# Altium project WiFiNode_R00.PrjPcb
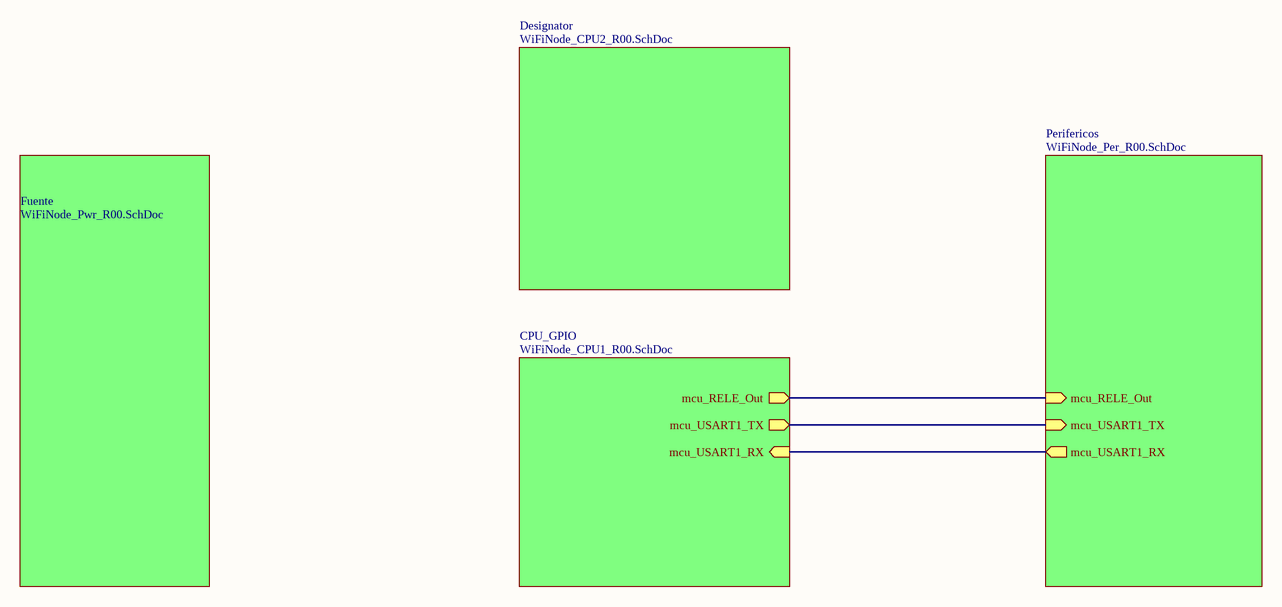
[diagram p0: WiFiNode_Blk_R00.SchDoc]
5 sheets, 52 parts. Net scope: hierarchical (ports join the sheet entries above them; power ports are global).
Board files: WiFiNode_R00.PcbDoc, WiFiNode_panel.PcbDoc
Sheets:
  WiFiNode_Blk_R00.SchDoc
    Fuente = WiFiNode_Pwr_R00.SchDoc
    Designator = WiFiNode_CPU2_R00.SchDoc
    CPU_GPIO = WiFiNode_CPU1_R00.SchDoc
    Perifericos = WiFiNode_Per_R00.SchDoc

## Sheet WiFiNode_Blk_R00.SchDoc: Nodo WiFi
size A4; Author: Hernan M. Travado; Revision: 0; SheetNumber: 1; SheetTotal: 5

### Sub-sheets
CPU_GPIO = WiFiNode_CPU1_R00.SchDoc: mcu_RELE_Out (out), mcu_USART1_TX (out), mcu_USART1_RX (in)
Designator = WiFiNode_CPU2_R00.SchDoc: no entries
Fuente = WiFiNode_Pwr_R00.SchDoc: no entries
Perifericos = WiFiNode_Per_R00.SchDoc: mcu_RELE_Out (in), mcu_USART1_TX (in), mcu_USART1_RX (out)

### Nets
mcu_RELE_OUT: sheet CPU_GPIO/mcu_RELE_Out, sheet Perifericos/mcu_RELE_Out
mcu_USART1_RX: sheet CPU_GPIO/mcu_USART1_RX, sheet Perifericos/mcu_USART1_RX
mcu_USART1_TX: sheet CPU_GPIO/mcu_USART1_TX, sheet Perifericos/mcu_USART1_TX

### Notes on the sheet
- Title:
- Size:
- Author:
- A4
- Sheet
- of
- Revision:
- File:
- Date:

## Sheet WiFiNode_Pwr_R00.SchDoc: Nodo WiFi
size A4; Author: Hernan M. Travado; Revision: 0; SheetNumber: 2; SheetTotal: 5
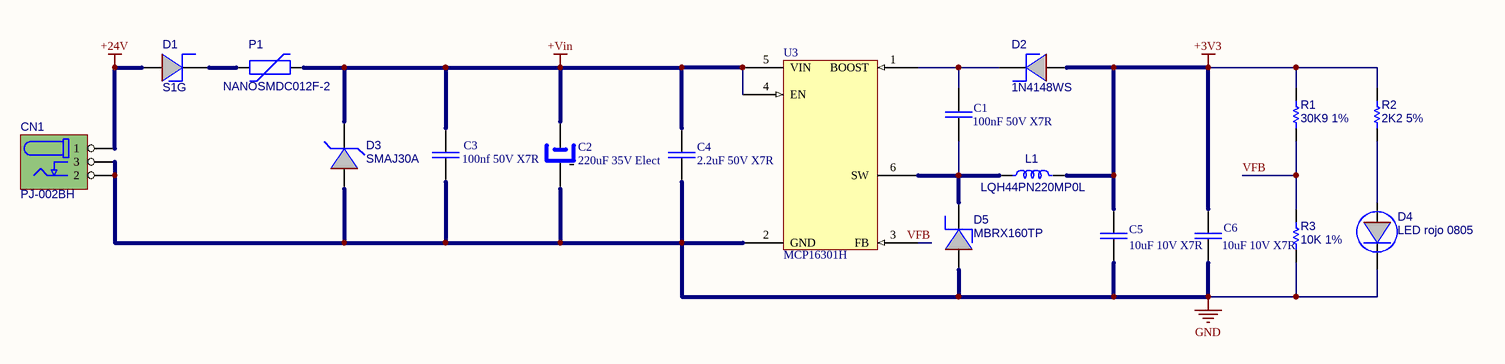
[diagram p1: WiFiNode_Pwr_R00.SchDoc]

### Parts
C1  100nF 50V X7R  [C_0805]
C2  220uF 35V Elect  [C_RAD_0.135_H_8X12_S]
C3  100nf 50V X7R  [C_0805]
C4  2.2uF 50V X7R  [C_0805]
C5  10uF 10V X7R  [C_0805]
C6  10uF 10V X7R  [C_0805]
CN1  PJ-002BH  [PJ002B]
D1  S1G  [D_SMA]
D2  1N4148WS  [SOD_323]
D3  SMAJ30A  [D_SMA]
D4  LED rojo 0805  [D_0805]
D5  MBRX160TP  [SOD_123]
L1  LQH44PN220MP0L  [LQH44]
P1  NANOSMDC012F-2  [NANOSMDC]
R1  30K9 1%  [R_0805]
R2  2K2 5%  [R_0805]
R3  10K 1%  [R_0805]
U3  MCP16301H  [SOT23-6]

### Nets
+3V3: C5.1 C6.1 D2.1(A) L1.2 R1.2 R2.2
+24V: CN1.1 D1.1(A)
+Vin: C2.1 C3.1 C4.1 D3.2(K) P1.2 U3.4(EN) U3.5(VIN)
GND: C2.2 C3.2 C4.2 C5.2 C6.2 CN1.2 CN1.3 D3.1(A) D4.2(K) D5.1(A) R3.1 U3.2(GND)
VFB: R1.1 R3.2 U3.3(FB)
NetC1_1: C1.1 D2.2(K) U3.1(BOOST)
NetC1_2: C1.2 D5.2(K) L1.1 U3.6(SW)
NetD1_2: D1.2(K) P1.1
NetD4_1: D4.1(A) R2.1

### Notes on the sheet
- Title:
- Size:
- Author:
- A4
- Sheet
- of
- Revision:
- File:
- Date:

### Library data of the parts
C1 C3-C6 = Ceramic capacitor
C2 = Pol capacitor: Polarized Capacitor
CN1 = CN_PowerJack: Barrel Power Connector
D1 D2 D5 = DIODO_SH: Diode Shottky
D3 = DIODE_TVS: Unidirectional TVS
D4 = LED
L1 = IND: Inductor
P1 = PLYSW: Polyswitch
R1-R3 = Res1: Resistor
U3 = MCP16301: Sted down switching

## Sheet WiFiNode_CPU2_R00.SchDoc: Node WiFi
size A4; Author: Hernan M. Travado; Revision: 0; SheetNumber: 5; SheetTotal: 5
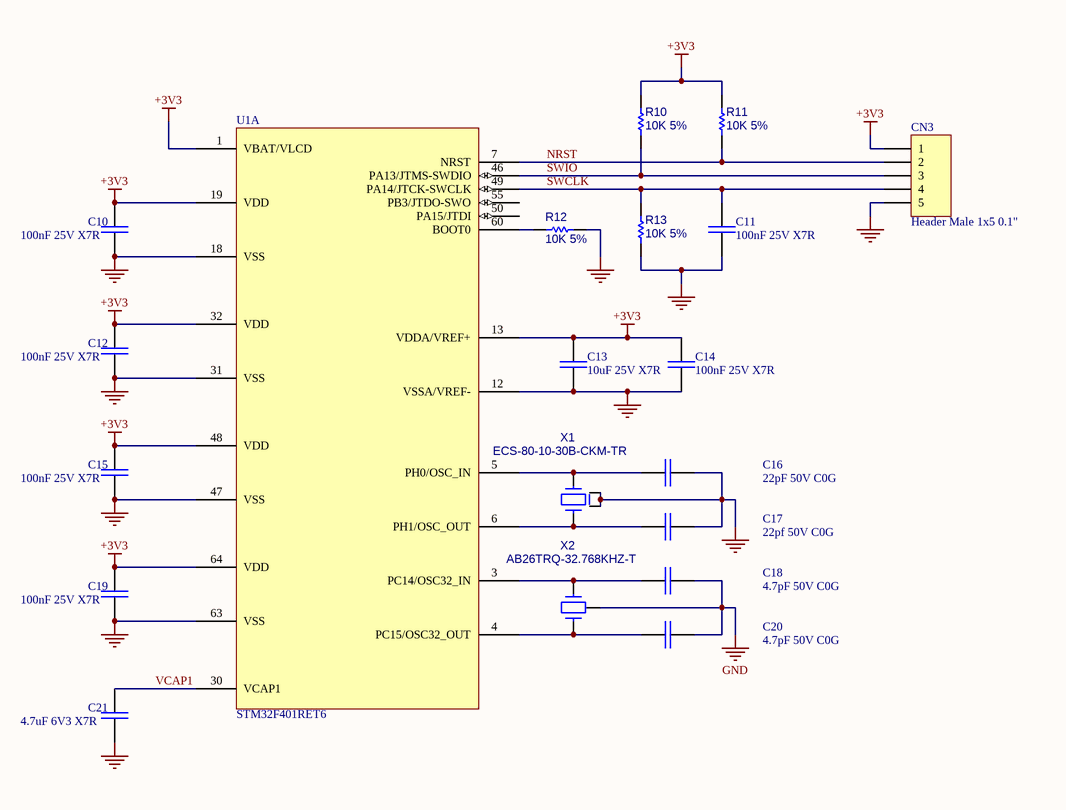
[diagram p2: WiFiNode_CPU2_R00.SchDoc]

### Parts
C10  100nF 25V X7R  [C_0805]
C11  100nF 25V X7R  [C_0805]
C12  100nF 25V X7R  [C_0805]
C13  10uF 25V X7R  [C_0805]
C14  100nF 25V X7R  [C_0805]
C15  100nF 25V X7R  [C_0805]
C16  22pF 50V C0G  [C_0805]
C17  22pf 50V C0G  [C_0805]
C18  4.7pF 50V C0G  [C_0805]
C19  100nF 25V X7R  [C_0805]
C20  4.7pF 50V C0G  [C_0805]
C21  4.7uF 6V3 X7R  [C_0805]
CN3  Header Male 1x5 0.1"  [Header_M_1x5_0.1"]
R10  10K 5%  [R_0805]
R11  10K 5%  [R_0805]
R12  10K 5%  [R_0805]
R13  10K 5%  [R_0805]
U1  STM32F401RET6  [LQFP_64]  (part A of 2)
X1  ECS-80-10-30B-CKM-TR  [ABM3C]
X2  AB26TRQ-32.768KHZ-T  [AB26TQF]

### Nets
+3V3: C10.1 C12.1 C13.1 C14.1 C15.1 C19.1 CN3.1 R10.1 R11.1 U1.1(VBAT/VLCD) U1.13(VDDA/VREF+) U1.19(VDD) U1.32(VDD) U1.48(VDD) U1.64(VDD)
GND: C10.2 C11.2 C12.2 C13.2 C14.2 C15.2 C16.2 C17.2 C18.2 C19.2 C20.2 C21.2 CN3.5 R12.1 R13.2 U1.12(VSSA/VREF-) U1.18(VSS) U1.31(VSS) U1.47(VSS) U1.63(VSS) X1.2 X1.4 X2.3
NRST: CN3.2 R11.2 U1.7(NRST)
SWCLK: C11.1 CN3.4 R13.1 U1.49(PA14/JTCK-SWCLK)
SWIO: CN3.3 R10.2 U1.46(PA13/JTMS-SWDIO)
VCAP1: C21.1 U1.30(VCAP1)
NetC16_1: C16.1 U1.5(PH0/OSC_IN) X1.1
NetC17_1: C17.1 U1.6(PH1/OSC_OUT) X1.3
NetC18_1: C18.1 U1.3(PC14/OSC32_IN) X2.2
NetC20_1: C20.1 U1.4(PC15/OSC32_OUT) X2.1
NetR12_2: R12.2 U1.60(BOOT0)

Not connected (* = marked no-connect by the designer): U1 50(PA15/JTDI) 55(PB3/JTDO-SWO)

### Notes on the sheet
- Title:
- Size:
- Author:
- A4
- Sheet
- of
- Revision:
- File:
- Date:

### Library data of the parts
C10-C21 = Ceramic capacitor
CN3 = CONN_05P: Connector Generic 5 Vias
R10-R13 = Res1: Resistor
U1 = STM32F401RE
X1 = CRYSTAL_4P: Crystal 4 Vias + GND
X2 = CRYSTAL 3P: Crystal 2 Vias + GND

## Sheet WiFiNode_CPU1_R00.SchDoc: Nodo WiFi
size A4; Author: Hernan M. Travado; Revision: 0; SheetNumber: 3; SheetTotal: 5
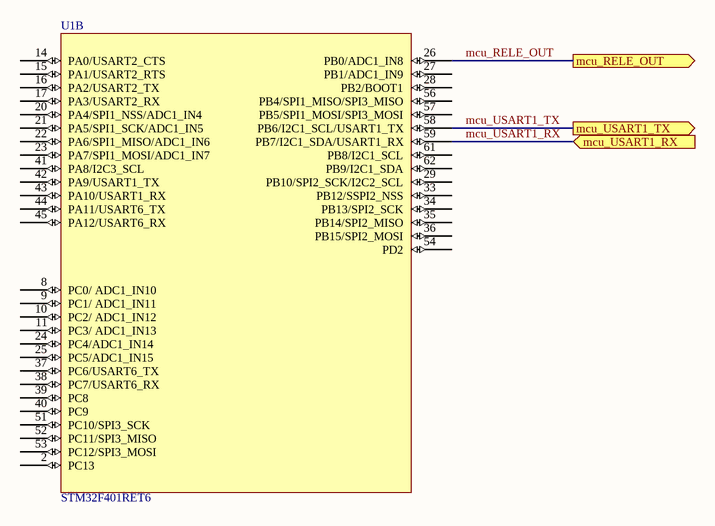
[diagram p3: WiFiNode_CPU1_R00.SchDoc]

### Parts
U1  STM32F401RET6  [LQFP_64]  (part B of 2)

### Ports
mcu_RELE_OUT (out, see WiFiNode_Blk_R00[3C], WiFiNode_Per_R00[1C]), mcu_USART1_RX (in, see WiFiNode_Blk_R00[3C], WiFiNode_Per_R00[3A]), mcu_USART1_TX (out, see WiFiNode_Blk_R00[3C], WiFiNode_Per_R00[3A])

### Nets
mcu_RELE_OUT: U1.26(PB0/ADC1_IN8) ; port mcu_RELE_OUT
mcu_USART1_RX: U1.59(PB7/I2C1_SDA/USART1_RX) ; port mcu_USART1_RX
mcu_USART1_TX: U1.58(PB6/I2C1_SCL/USART1_TX) ; port mcu_USART1_TX

Not connected (* = marked no-connect by the designer): U1 2(PC13) 8(PC0/_ADC1_IN10) 9(PC1/_ADC1_IN11) 10(PC2/_ADC1_IN12) 11(PC3/_ADC1_IN13) 14(PA0/USART2_CTS) 15(PA1/USART2_RTS) 16(PA2/USART2_TX) 17(PA3/USART2_RX) 20(PA4/SPI1_NSS/ADC1_IN4) 21(PA5/SPI1_SCK/ADC1_IN5) 22(PA6/SPI1_MISO/ADC1_IN6) 23(PA7/SPI1_MOSI/ADC1_IN7) 24(PC4/ADC1_IN14) 25(PC5/ADC1_IN15) 27(PB1/ADC1_IN9) 28(PB2/BOOT1) 29(PB10/SPI2_SCK/I2C2_SCL) 33(PB12/SSPI2_NSS) 34(PB13/SPI2_SCK) 35(PB14/SPI2_MISO) 36(PB15/SPI2_MOSI) 37(PC6/USART6_TX) 38(PC7/USART6_RX) 39(PC8) 40(PC9) 41(PA8/I2C3_SCL) 42(PA9/USART1_TX) 43(PA10/USART1_RX) 44(PA11/USART6_TX) 45(PA12/USART6_RX) 51(PC10/SPI3_SCK) 52(PC11/SPI3_MISO) 53(PC12/SPI3_MOSI) 54(PD2) 56(PB4/SPI1_MISO/SPI3_MISO) 57(PB5/SPI1_MOSI/SPI3_MOSI) 61(PB8/I2C1_SCL) 62(PB9/I2C1_SDA)

### Notes on the sheet
- Title:
- Size:
- Author:
- A4
- Sheet
- of
- Revision:
- File:
- Date:

### Library data of the parts
U1 = STM32F401RE

## Sheet WiFiNode_Per_R00.SchDoc: Nodo WiFi
size A4; Author: Hernan M. Travado; Revision: 0; SheetNumber: 4; SheetTotal: 5
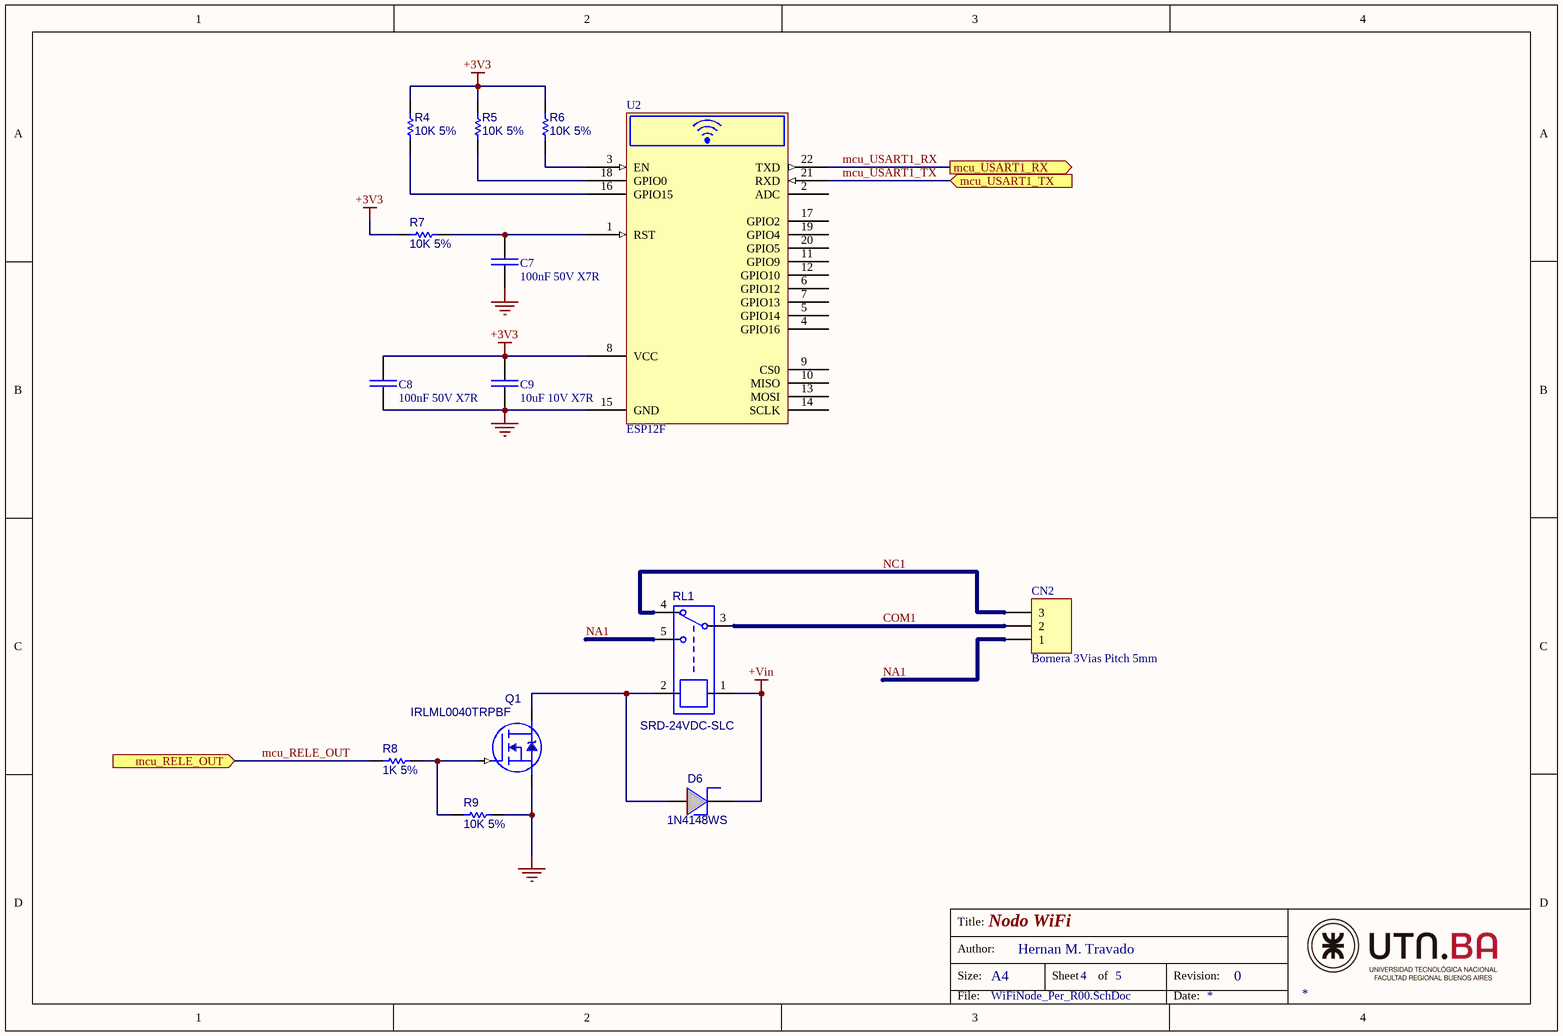
[diagram p4: WiFiNode_Per_R00.SchDoc]

### Parts
C7  100nF 50V X7R  [C_0805]
C8  100nF 50V X7R  [C_0805]
C9  10uF 10V X7R  [C_0805]
CN2  Bornera 3Vias Pitch 5mm  [TerminalBlock_1x3_P5mm]
D6  1N4148WS  [SOD_323]
Q1  IRLML0040TRPBF  [SOT_23]
R4  10K 5%  [R_0805]
R5  10K 5%  [R_0805]
R6  10K 5%  [R_0805]
R7  10K 5%  [R_0805]
R8  1K 5%  [R_0805]
R9  10K 5%  [R_0805]
RL1  SRD-24VDC-SLC  [943-1C]
U2  ESP12F  [ESP12F]

### Ports
mcu_RELE_OUT (in, see WiFiNode_Blk_R00[4C], WiFiNode_CPU1_R00[3B]), mcu_USART1_RX (out, see WiFiNode_Blk_R00[4C], WiFiNode_CPU1_R00[3B]), mcu_USART1_TX (in, see WiFiNode_Blk_R00[4C], WiFiNode_CPU1_R00[3B])

### Nets
+3V3: C8.1 C9.1 R4.2 R5.2 R6.2 R7.2 U2.8(VCC)
+Vin: D6.2(K) RL1.1
GND: C7.2 C8.2 C9.2 Q1.2(SOURCE) R9.1 U2.15(GND)
COM1: CN2.2 RL1.3
mcu_RELE_OUT: R8.2 ; port mcu_RELE_OUT
mcu_USART1_RX: U2.22(TXD) ; port mcu_USART1_RX
mcu_USART1_TX: U2.21(RXD) ; port mcu_USART1_TX
NA1: CN2.1 RL1.5
NC1: CN2.3 RL1.4
NetC7_1: C7.1 R7.1 U2.1(RST)
NetD6_1: D6.1(A) Q1.3(DRAIN) RL1.2
NetQ1_1: Q1.1(GATE) R8.1 R9.2
NetR4_1: R4.1 U2.16(GPIO15)
NetR5_1: R5.1 U2.18(GPIO0)
NetR6_1: R6.1 U2.3(EN)

Not connected (* = marked no-connect by the designer): U2 2(ADC) 4(GPIO16) 5(GPIO14) 6(GPIO12) 7(GPIO13) 9(CS0) 10(MISO) 11(GPIO9) 12(GPIO10) 13(MOSI) 14(SCLK) 17(GPIO2) 19(GPIO4) 20(GPIO5)

### Notes on the sheet
- Title:
- Size:
- Author:
- A4
- Sheet
- of
- Revision:
- File:
- Date:

### Library data of the parts
C7-C9 = Ceramic capacitor
CN2 = CONN_03P: Connector Generic 3 Vias
D6 = DIODO_SH: Diode Shottky
Q1 = N_MOSFET_SOT23: Mosfet N-Ch
R4-R9 = Res1: Resistor
RL1 = RELAY SPDT
U2 = ESP12F Wifi Module: Wifi Module

## Nets that join several sheets
+3V3: WiFiNode_Pwr_R00 (6 pins), WiFiNode_CPU2_R00 (15 pins), WiFiNode_Per_R00 (7 pins)
+Vin: WiFiNode_Pwr_R00 (7 pins), WiFiNode_Per_R00 (D6.2 RL1.1)
GND: WiFiNode_Pwr_R00 (12 pins), WiFiNode_CPU2_R00 (23 pins), WiFiNode_Per_R00 (6 pins)
mcu_RELE_OUT: WiFiNode_CPU1_R00 (U1.26), WiFiNode_Per_R00 (R8.2)
mcu_USART1_RX: WiFiNode_CPU1_R00 (U1.59), WiFiNode_Per_R00 (U2.22)
mcu_USART1_TX: WiFiNode_CPU1_R00 (U1.58), WiFiNode_Per_R00 (U2.21)